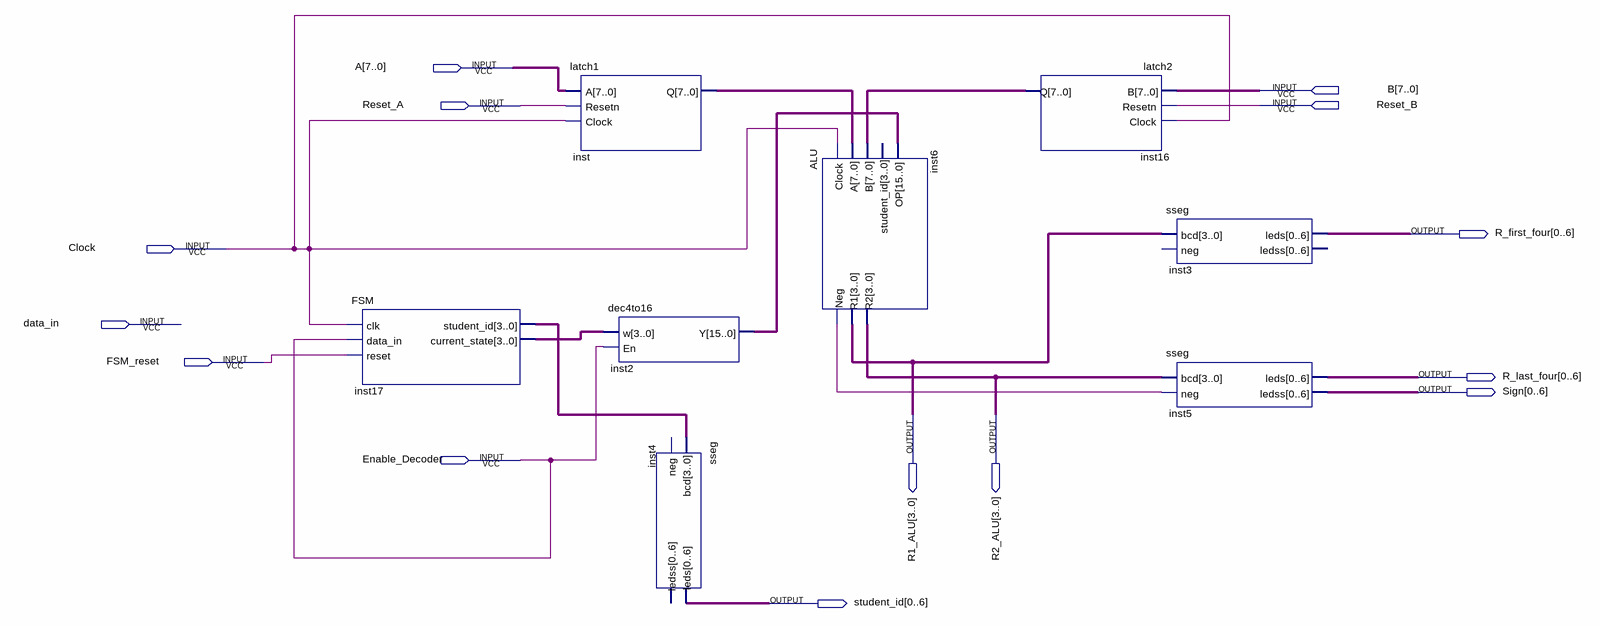
[diagram p0: schematic sheet]
// Quartus schematic Problem1.bdf as structural Verilog: 8 symbols, 14 pins
module Problem1 (
  input  [7:0] A,
  input  [7:0] B,
  input  Reset_A,
  input  Reset_B,
  input  Clock,
  input  data_in,
  input  FSM_reset,
  input  Enable_Decoder,
  output [0:6] R_first_four,
  output [0:6] R_last_four,
  output [0:6] Sign,
  output [3:0] R1_ALU,
  output [3:0] R2_ALU,
  output [0:6] student_id
);

  wire inst6_neg;
  wire [3:0] inst17_current_state, inst17_student_id;
  wire [7:0] inst16_q, inst_q;
  wire [15:0] inst2_y;

  FSM inst17 (
    .clk(Clock), .data_in(Enable_Decoder), .reset(FSM_reset), .student_id(inst17_student_id),
    .current_state(inst17_current_state));
  latch1 inst (.A(A), .Resetn(Reset_A), .Clock(Clock), .Q(inst_q));
  dec4to16 inst2 (.w(inst17_current_state), .En(Enable_Decoder), .Y(inst2_y));
  sseg inst4 (.bcd(inst17_student_id), .leds(student_id));  // open: neg, ledss
  ALU inst6 (
    .Clock(Clock), .A(inst_q), .B(inst16_q), .OP(inst2_y), .Neg(inst6_neg), .R1(R1_ALU), .R2(R2_ALU));  // open: student_id
  latch2 inst16 (.B(B), .Resetn(Reset_B), .Clock(Clock), .Q(inst16_q));
  sseg inst3 (.bcd(R1_ALU), .leds(R_first_four));  // open: neg, ledss
  sseg inst5 (.bcd(R2_ALU), .neg(inst6_neg), .leds(R_last_four), .ledss(Sign));
endmodule
